# EAGLE design dc-dc_0_2 (EAGLE 6.1)
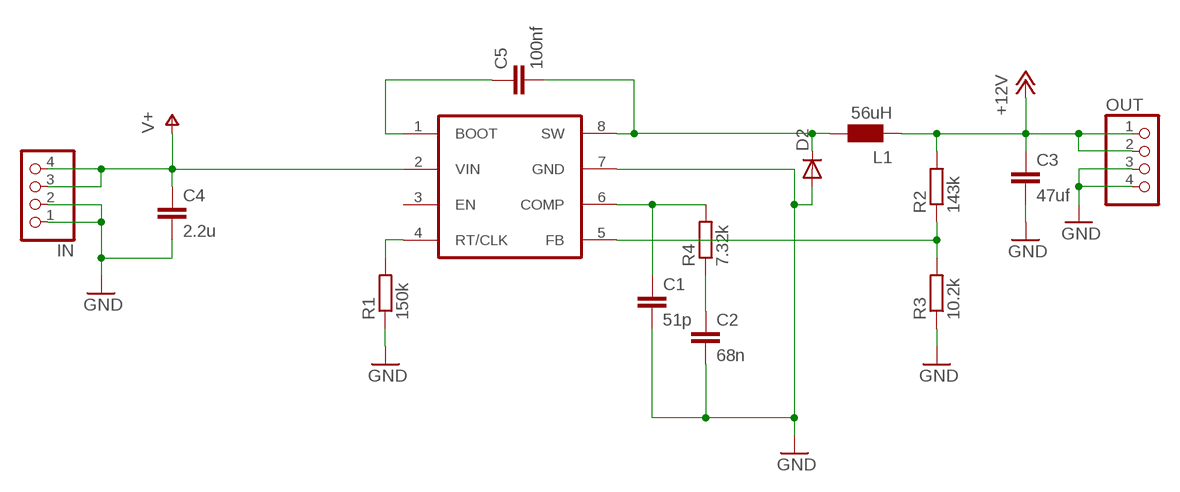
[diagram p0: schematic, sheet 1]

## Parts
C1  51p  C-EUC0805  [C0805]
C2  68n  C-EUC1206  [C1206]
C3  47uf  C-EUC1210  [C1210]
C4  2.2u  C-EUC1210  [C1210]
C5  100nf  C-EUC0805  [C0805]
D2  DIODE-DO-214AC  [DO-214AC]
IN  PINHD-1X4  [1X04]
L1  56uH  WE-PD_L/XL/XXL  [WE-PD_L/XL/XXL]
OUT  PINHD-1X4  [1X04]
R1  150k  R-EU_R0805  [R0805]
R2  143k  R-EU_R0805  [R0805]
R3  10.2k  R-EU_R0805  [R0805]
R4  7.32k  R-EU_R0805  [R0805]
U1  TPS54560  [SO08-POWERPAD]

## Nets
+12V: C3.1 L1.2 OUT.1 OUT.2 R2.2
GND: C1.2 C2.2 C3.2 C4.2 D2.A IN.1 IN.2 OUT.3 OUT.4 R1.1 R3.1 U1.7(GND)
N$1: C5.1 U1.1(BOOT)
N$2: C5.2 D2.C L1.1 U1.8(SW)
N$4: R2.1 R3.2 U1.5(FB)
N$5: C1.1 R4.2 U1.6(COMP)
N$6: C2.1 R4.1
N$8: R1.2 U1.4(RT/CLK)
V+: C4.1 IN.3 IN.4 U1.2(VIN)
Unconnected: U1.3(EN)

## Library data of the parts
C1-C5 = rcl:C-EU: CAPACITOR, European symbol
D2 = diode:DIODE-: DIODE
IN OUT = pinhead:PINHD-1X4: PIN HEADER
L1 = wuerth-elektronik:WE-PD: SMD-Shielded Power Inductors WE-PD Is recommended for the application with switching regulators from National Semiconductor, Linear Technology, Texas Instruments and Fairchild Semiconductor - Magnetically shielded version which results in a low leakage field - High storage capacity - Low self-losses -- Switching regulators with low operating voltages (computer, laptop, mobile phones, pagers) -- Integrated DC/DC-converter
R1-R4 = rcl:R-EU_: RESISTOR, European symbol
U1 = TPS54560:TPS54560

## Board
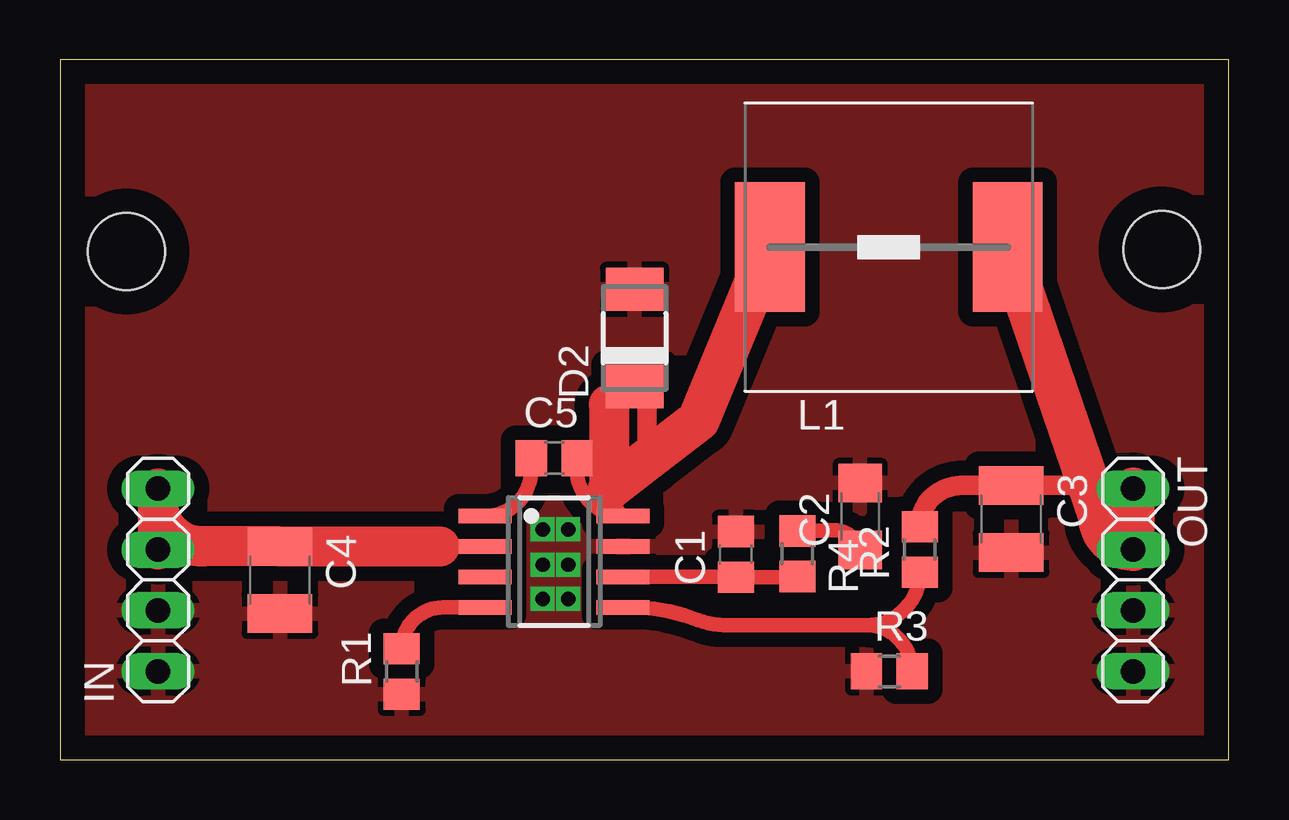
[diagram p1: board, top side]
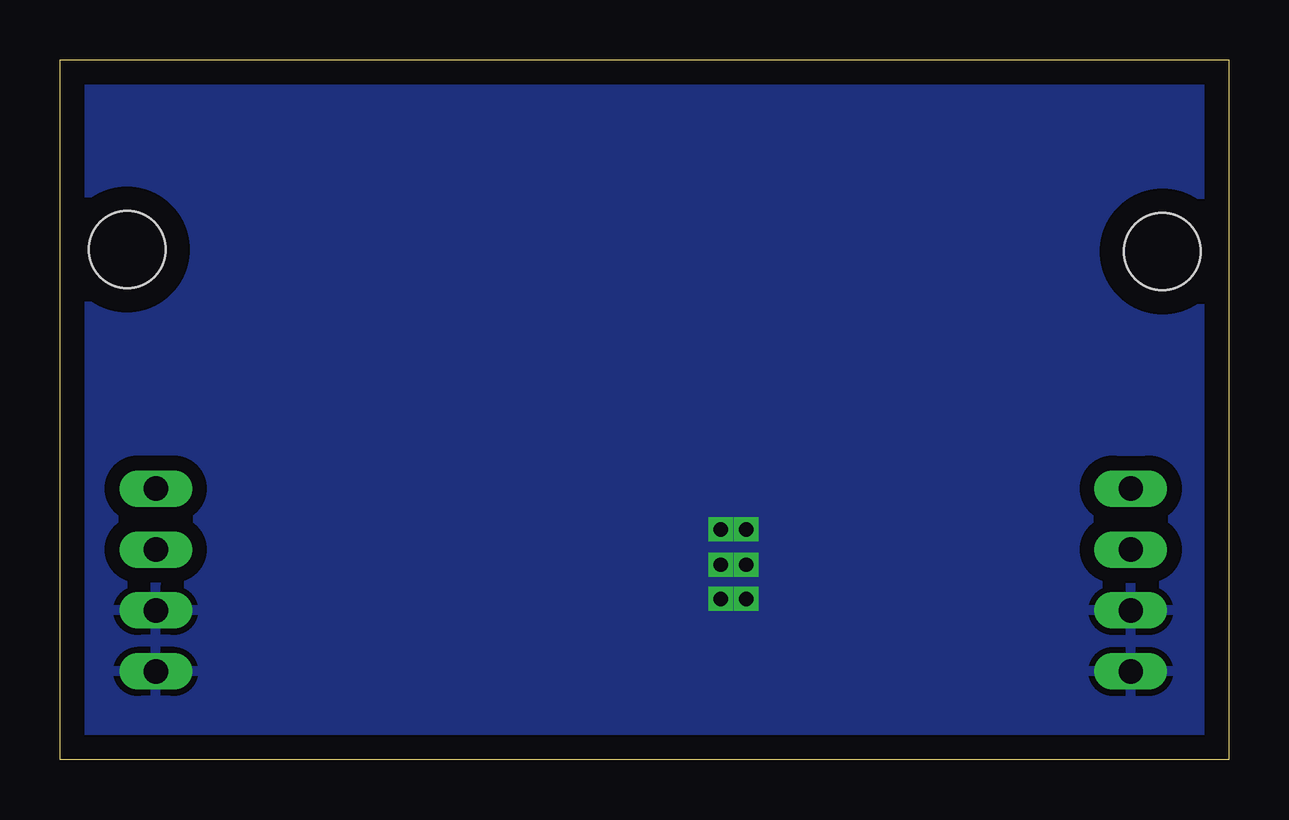
[diagram p2: board, bottom side, seen from below]

Size 48.72 x 29.16 mm. Coordinates in mm from the lower left corner, seen from the top.
Outline: 0,0 48.72,0 48.72,29.16 0,29.16 0,0
Copper layers (1*16): Top 0.035mm / dielectric 1.5mm / Bottom 0.035mm
Design rules: minimum track width 10mil, minimum drill 0.6mm, track to track 8mil, track to pad 8mil, pad to pad 8mil, via to via 8mil, smd to smd 8mil, copper to edge 40mil, drill to drill 8mil, minimum pad ring 10mil, minimum via ring 8mil, stop-mask expansion 4mil, vias tented up to drill 0mil, thermal gap 10mil
Holes 3.2 mm at 2.77,21.18 45.92,21.26

### Footprints (pad centres in the part's own frame; a part is rotated, then mirrored left to right if it is on the bottom)
C0805 = smd 1.3 x 1.5: 1 -0.95,0; 2 0.95,0
C1206 = smd 1.6 x 1.8: 1 -1.4,0; 2 1.4,0
C1210 = smd 1.6 x 2.7: 1 -1.4,0; 2 1.4,0
DO-214AC = smd 1.8 x 2.4: A 2.025,0; C -2.025,0
1X04 = drill 1.016 long: 1 -3.81,0; 2 -1.27,0; 3 1.27,0; 4 3.81,0
WE-PD_L/XL/XXL = smd 2.9 x 5.4: 1 -4.95,0; 2 4.95,0
R0805 = smd 1.3 x 1.5: 1 -0.95,0; 2 0.95,0
SO08-POWERPAD = smd 0.6 x 2.2: 1 -1.905,-2.875; 2 -0.635,-2.875; 3 0.635,-2.875; 4 1.905,-2.875; 5 1.905,2.875; 6 0.635,2.875; 7 -0.635,2.875; 8 -1.905,2.875

### Placement (x,y rotation side)
C1  28.17,8.56 90 top
C2  33.35,10.13 90 top
C3  39.65,10.03 270 top
C4  9.17,7.49 270 top
C5  20.6,12.57 0 top
D2  23.95,17.58 90 top
IN  4.09,7.49 90 top
L1  34.54,21.36 0 top
OUT  44.73,7.49 270 top
R1  14.25,3.68 90 top
R2  35.84,8.76 90 top
R3  34.57,3.68 0 top
R4  30.73,8.59 270 top
U1  20.6,8.25 270 top

### Tracks (layer width: path | path; a pad name or v marks a point on that pad's centre or on a via)
+12V
  Top 0.813: R2.2 arc-90 37.56,11.43 C3.1 42.06,11.43 arc-90 OUT.2
  Top 1.778: OUT.1 OUT.2 arc-90 43.33,10.16 L1.2
GND  (via drill 0.6)
  other vias: 20.12,6.71 20.12,9.6 21.18,9.6 21.18,8.13 20.12,8.13 21.18,6.71
  pour Bottom (isolate 0.61): -0.99,37.97 49.81,37.97 49.81,-2.67 -0.99,-2.67
  pour Top (isolate 0.61): -2.26,39.24 51.08,39.24 51.08,-3.94 -2.26,-3.94
N$1
  Top 0.61: U1.1 arc90 19.65,12.08 C5.1
N$2
  Top 0.406: U1.8 22.89,11.28
  Top 0.61: U1.8 arc-90 21.55,12.08 C5.2
  Top 0.813: D2.C 24.48,15.03 24.48,12.5
  Top 1.676: 22.89,14.8 22.89,11.28
  Top 1.778: L1.1 26.62,14.15 24.48,12.5 22.89,11.28
N$4
  Top 0.61: 33.59,5.61 arc-90 R3.2 | 33.59,5.61 33.64,5.61 arc90 R2.1 | 33.59,5.61 27.69,5.61 arc-22 26.62,5.82 arc24 U1.5
N$5
  Top 0.61: U1.6 C1.1 arc-90 C1.1 30.71,7.61 arc90 R4.2
N$6
  Top 0.61: R4.1 31.97,9.54 arc-90 C2.1
N$8
  Top 0.61: U1.4 15.97,6.35 arc90 R1.2
V+
  Top 0.61: U1.2 15.82,8.89
  Top 1.676: IN.3 4.09,10.67 | 4.09,10.67 IN.4 | 4.09,10.67 arc90 5.99,8.89 C4.1 15.82,8.89